# EAGLE board main_oled (EAGLE 9.6.2)
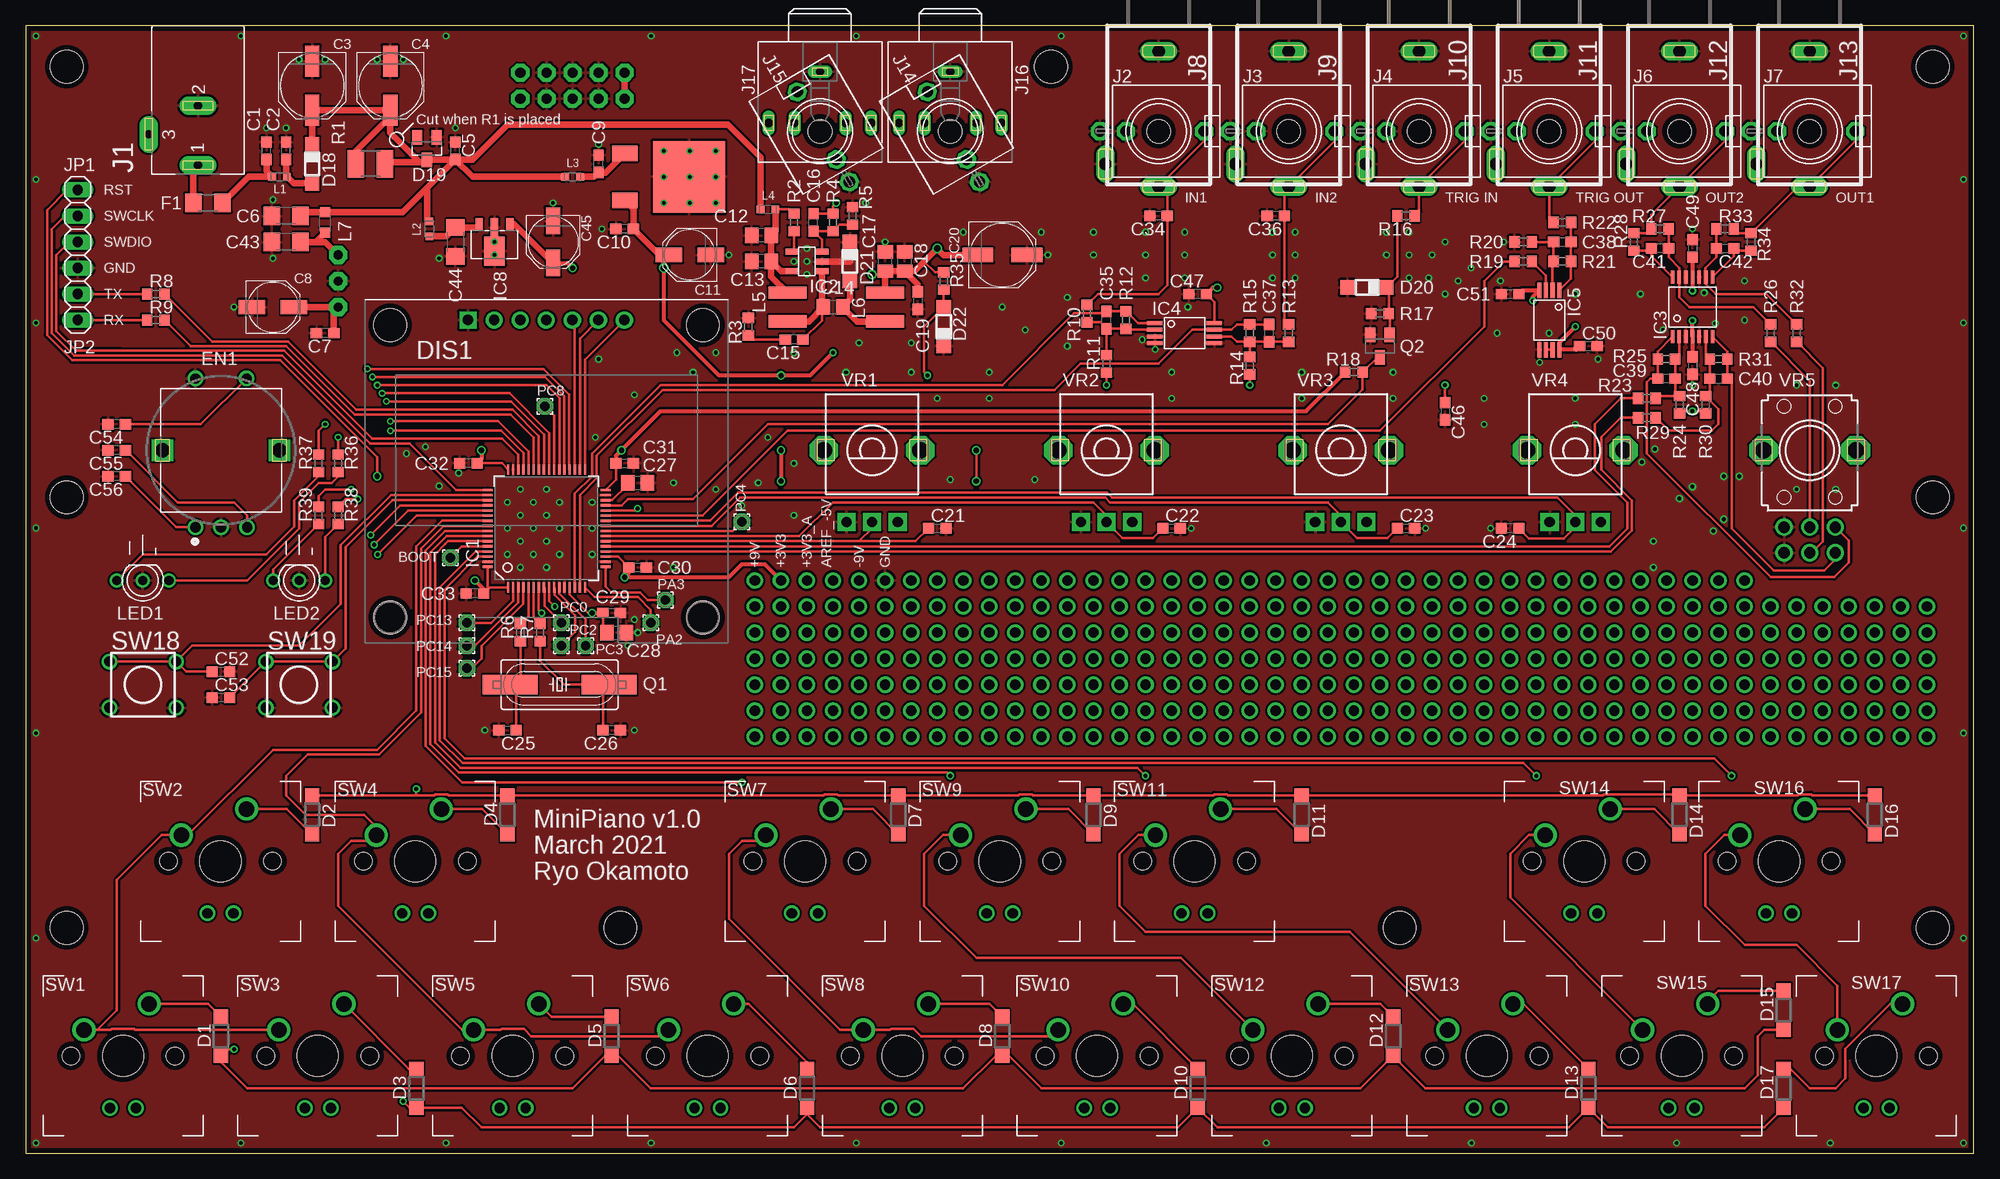
[diagram p4: board, top side]
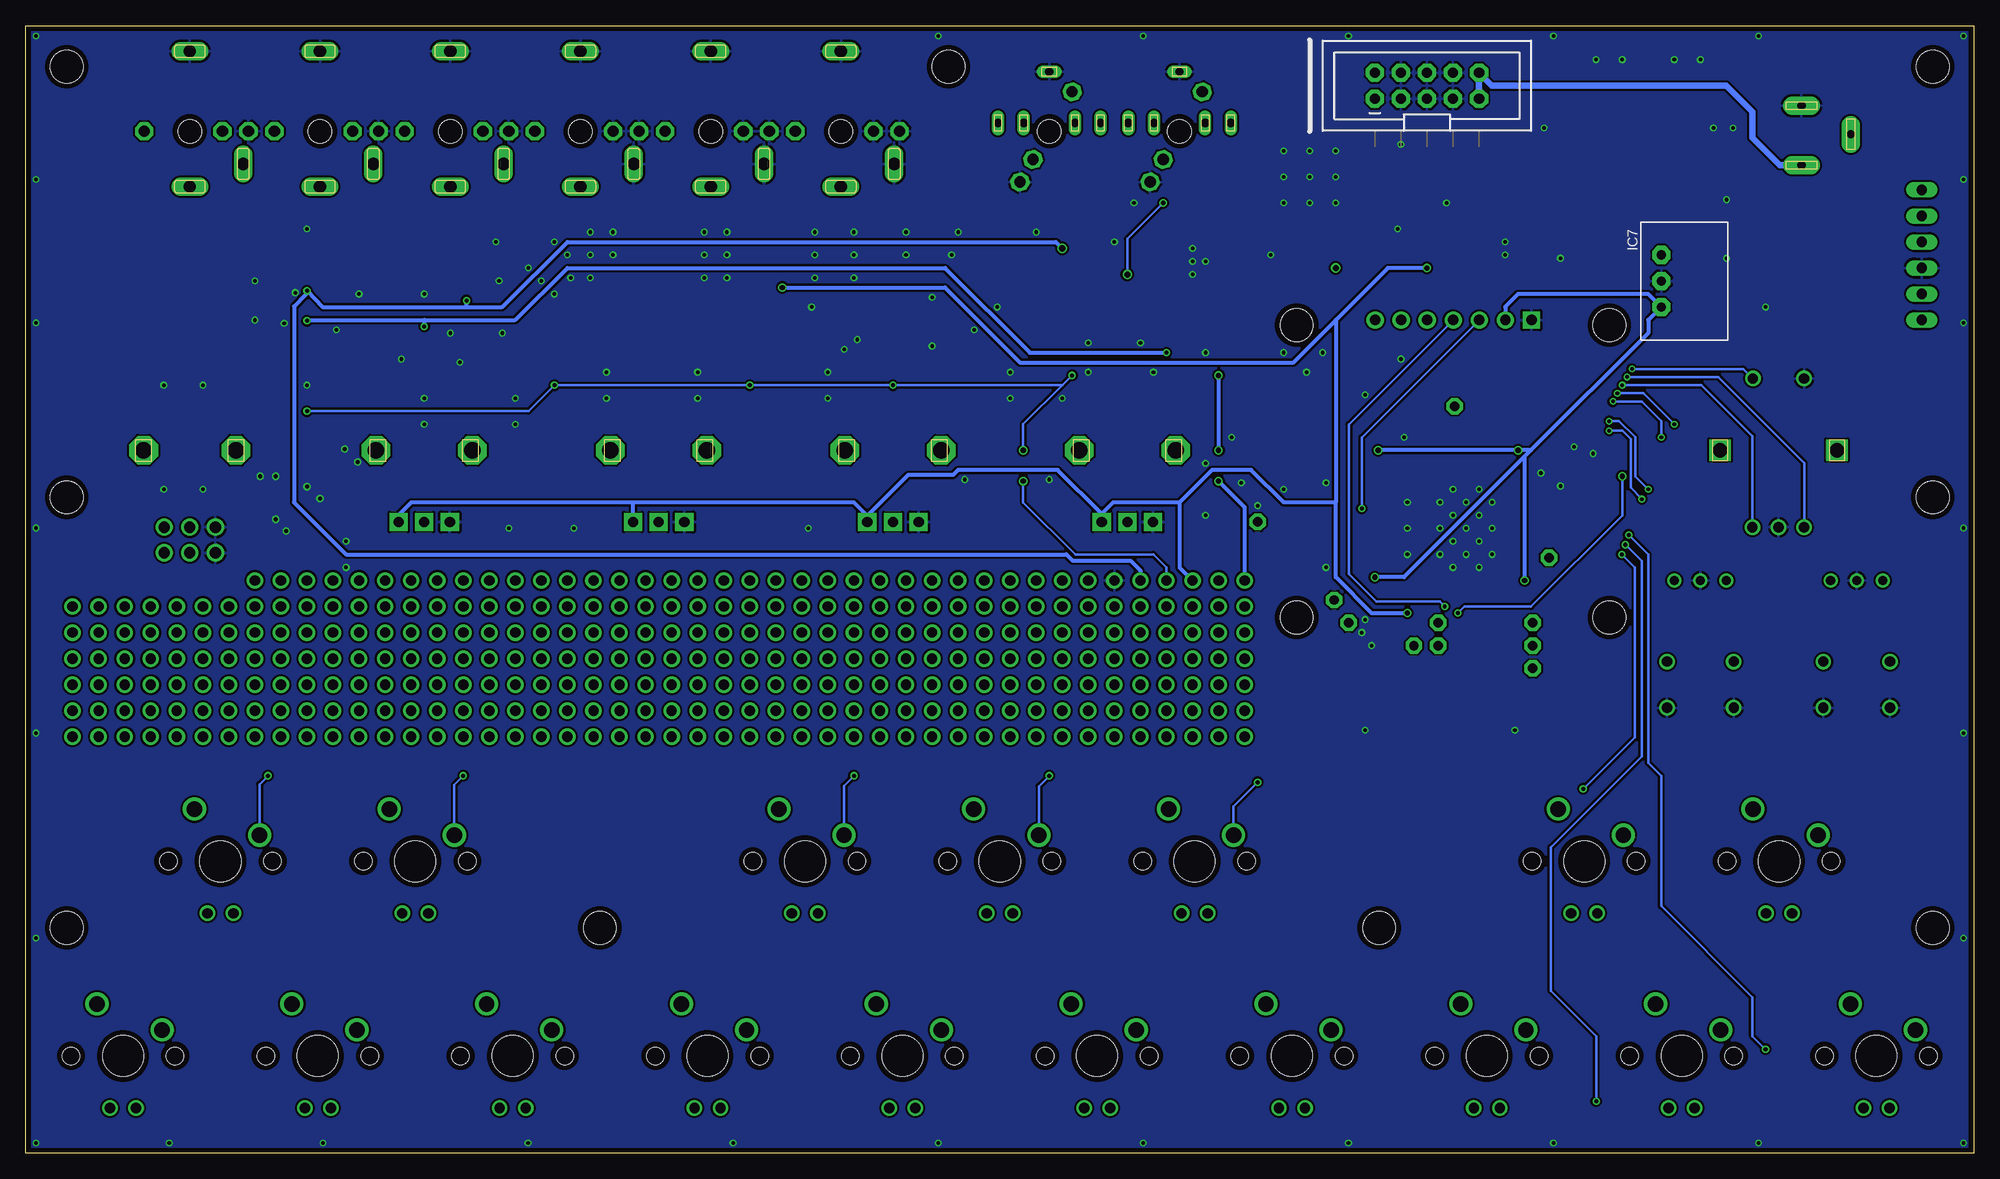
[diagram p5: board, bottom side, seen from below]

Size 190 x 110 mm. Coordinates in mm from the lower left corner, seen from the top.
Outline: 0,0 190,0 190,110 0,110 0,0
Copper layers (1*16): Top 0.035mm / dielectric 1.6mm / Bottom 0.035mm
Design rules "Elecrow_2-layer_PCB_eagle_rule_recom": minimum track width 8mil, minimum drill 12mil, track to track 8mil, track to pad 8mil, pad to pad 8mil, via to via 8mil, smd to smd 0mil, copper to edge 20mil, drill to drill 10mil, minimum pad ring 6mil, minimum via ring 6mil, stop-mask expansion 0mil, vias tented up to drill 100mil, thermal gap 10mil
Net classes: 0 default: width 0.254 mm; 1 GND: width 0.254 mm; 2 VCC: width 0.254 mm, drill 0.4 mm
Holes 3.2 mm at 4,22 186,106 4,106 100,106 58,22 4,64 186,64 134,22 186,22 35.56,52.27 66.04,52.27

## Footprints (pad centres in the part's own frame; a part is rotated, then mirrored left to right if it is on the bottom)
1,6/0,9 = drill 0.914 pad 1.6 octagon: 1 0,0
C0603 = smd 1.1 x 1: 1 -0.85,0; 2 0.85,0
PANASONIC_D = smd 3 x 1.4: + 2.4,0; - -2.4,0
C1206 = smd 1.6 x 1.8: 1 -1.4,0; 2 1.4,0
PANASONIC_C = smd 2.6 x 1.4: + 2.05,0; - -2.05,0
C0805 = smd 1.3 x 1.5: 1 -0.95,0; 2 0.95,0
SOD123 = smd 1.4 x 1.4: A 1.9,0; C -1.9,0
SOT23 = smd 1 x 1.4: 1 -0.95,-1.1; 2 0.95,-1.1; 3 0,1.1
OLED_130_SPI = drill 1.016 pad 1.676 square: 1 -7.65,12.7 | drill 1.016 pad 1.676: 2 -5.11,12.7; 3 -2.57,12.7; 4 -0.03,12.7; 5 2.51,12.7; 6 5.05,12.7; 7 7.59,12.7 | hole 3.2: -15.24,12.21; 15.24,12.21
PEC11L-4220F-S0015 = drill 1: 1 -2.5,7; 2 2.5,7; A -2.5,-7.5; B 2.55,-7.5; C 0,-7.5 | drill 1.4 square: M1 -5.7,0; M2 5.7,0
R1206 = smd 1.6 x 1.803: 1 -1.422,0; 2 1.422,0
TQFP64 = smd 0.22 x 1: 1 -3.75,-5.75; 2 -3.25,-5.75; 3 -2.75,-5.75; 4 -2.25,-5.75; 5 -1.75,-5.75; 6 -1.25,-5.75; 7 -0.75,-5.75; 8 -0.25,-5.75; 9 0.25,-5.75; 10 0.75,-5.75; 11 1.25,-5.75; 12 1.75,-5.75; 13 2.25,-5.75; 14 2.75,-5.75; 15 3.25,-5.75; 16 3.75,-5.75; 33 3.75,5.75; 34 3.25,5.75; 35 2.75,5.75; 36 2.25,5.75; 37 1.75,5.75; 38 1.25,5.75; 39 0.75,5.75; 40 0.25,5.75; 41 -0.25,5.75; 42 -0.75,5.75; 43 -1.25,5.75; 44 -1.75,5.75; 45 -2.25,5.75; 46 -2.75,5.75; 47 -3.25,5.75; 48 -3.75,5.75 | smd 1 x 0.22: 17 5.75,-3.75; 18 5.75,-3.25; 19 5.75,-2.75; 20 5.75,-2.25; 21 5.75,-1.75; 22 5.75,-1.25; 23 5.75,-0.75; 24 5.75,-0.25; 25 5.75,0.25; 26 5.75,0.75; 27 5.75,1.25; 28 5.75,1.75; 29 5.75,2.25; 30 5.75,2.75; 31 5.75,3.25; 32 5.75,3.75; 49 -5.75,3.75; 50 -5.75,3.25; 51 -5.75,2.75; 52 -5.75,2.25; 53 -5.75,1.75; 54 -5.75,1.25; 55 -5.75,0.75; 56 -5.75,0.25; 57 -5.75,-0.25; 58 -5.75,-0.75; 59 -5.75,-1.25; 60 -5.75,-1.75; 61 -5.75,-2.25; 62 -5.75,-2.75; 63 -5.75,-3.25; 64 -5.75,-3.75
SOT23-5 = smd 1.3 x 0.6: 1 -1.45,0.95; 2 -1.45,0; 3 -1.45,-0.95; 4 1.45,-0.95; 5 1.45,0.95
TSSOP14 = smd 1.26 x 0.36: 1 -2.9,1.95; 2 -2.9,1.3; 3 -2.9,0.65; 4 -2.9,0; 5 -2.9,-0.65; 6 -2.9,-1.3; 7 -2.9,-1.95; 8 2.9,-1.95; 9 2.9,-1.3; 10 2.9,-0.65; 11 2.9,0; 12 2.9,0.65; 13 2.9,1.3; 14 2.9,1.95
TSSOP8 = smd 1.5 x 0.4: 1 -2.9,0.975; 2 -2.9,0.325; 3 -2.9,-0.325; 4 -2.9,-0.975; 5 2.9,-0.975; 6 2.9,-0.325; 7 2.9,0.325; 8 2.9,0.975
TO252-3 = smd 7 x 7: GND 0,5 | smd 1.5 x 2.5: IN -2.3,-1.25; OUT 2.3,-1.25
R-78E = drill 0.9 pad 1.778 octagon: 1 -2.54,0; 2 0,0; 3 2.54,0
SOT89R = smd 0.7 x 1.1: 1 1.5,-1.75; 2 -1.5,-1.75 | smd 0.7 x 1.8: 3 0,-1.4 | smd 2 x 2.8: 4 0,0.9
694106301002 = drill 0.8 pad 1.8 long: 1 13.6,0; 2 7.8,0; 3 10.6,-4.8
WQP-PJ301M-12_JACK = drill 1.1 pad 1.778 octagon: 1 0,4.445; 2 0,-3.175; 3 0,-5.715 | hole 2.3: 0,0
PJ-302M = drill 1.2 long: S 2.5,0; T 15.7,0; TS 13.5,-5.2
SJ1-352X = drill 0.8 long: 1 4.5,0; 2 9.5,5; 3 9.5,2.5; 4 9.5,-2.5; 5 9.5,-5
1X04 = drill 1.016 long: 1 -3.81,0; 2 -1.27,0; 3 1.27,0; 4 3.81,0
1X02 = drill 1.016 long: 1 -1.27,0; 2 1.27,0
PIN_HEADER_SHROUDED_2X5 = drill 1 pad 1.778 octagon: 1 -5.08,-1.27; 2 -5.08,1.27; 3 -2.54,-1.27; 4 -2.54,1.27; 5 0,-1.27; 6 0,1.27; 7 2.54,-1.27; 8 2.54,1.27; 9 5.08,-1.27; 10 5.08,1.27
WE-CBF_0603(W=2.2) = smd 0.75 x 0.7: 1 -0.725,0; 2 0.725,0
NR40XX = smd 1.2 x 3.7: 1 -1.4,0; 2 1.4,0
L2012C = smd 1 x 1: 1 -1,0; 2 1,0
W115WSURKMGKW = drill 0.9: 1 -2.54,0; 2 0,0; 3 2.54,0
PERF_2.54 = drill 1 pad 1.6: 1 0,0
HC49UP = smd 5.334 x 1.93: 1 -4.826,0; 2 4.826,0
SOT23-BEC = smd 1 x 1.4: B -0.95,-1.1; C 0,1.1; E 0.95,-1.1
R1210 = smd 1.6 x 2.7: 1 -1.4,0; 2 1.4,0
R0603 = smd 1 x 1.1: 1 -0.85,0; 2 0.85,0
MX1A-XX[R/G/Y]W = drill 1.5: 1 -3.81,2.54; 2 2.54,5.08 | drill 1: 3 -1.27,-5.08; 4 1.27,-5.08 | hole 4: 0,0 | hole 1.7: -5.08,0; 5.08,0
TACT_TH = drill 1: P1 -3.25,2.25; P2 3.25,2.25; P3 -3.25,-2.25; P4 3.25,-2.25
9MM_V = drill 1 pad 1.778 square: 1 -2.5,-7; 2 0,-7; 3 2.5,-7 | drill 1.6 pad 2.8 octagon: M1 4.699,0; M2 -4.699,0
9MM_V_DUAL = drill 1.1 pad 1.676: 1 -2.5,-7.5; 2 0,-7.5; 3 2.5,-7.5; 4 -2.5,-10; 5 0,-10; 6 2.5,-10 | drill 1.6 pad 2.8 octagon: M1 4.5,0; M2 -4.5,0

## Placement (x,y rotation side)
BOOT  WIREPAD1,6/0,9  [1,6/0,9]  41.43,58.1 0 top
C1  0.01u  [C0603]  23.5,97.79 90 top
C2  0.01u  [C0603]  25.4,97.79 90 top
C3  100u  [PANASONIC_D]  27.94,104.14 270 top
C4  100u  [PANASONIC_D]  35.56,104.14 270 top
C5  0.1u  [C0603]  41.91,97.79 90 top
C6  22u  [C1206]  25.4,91.44 180 top
C7  0.1u  [C0603]  29.21,80.01 180 top
C8  22u  [PANASONIC_C]  24.13,82.55 0 top
C9  0.01u  [C0603]  55.88,96.52 90 top
C10  0.1u  [C0603]  58.42,90.17 180 top
C11  22u  [PANASONIC_C]  64.77,87.63 180 top
C12  10u  [C0805]  71.75,89.53 180 top
C13  1u  [C0805]  71.75,87 180 top
C14  2.2u  [C0805]  78.74,82.55 0 top
C15  220p  [C0603]  74.93,79.38 180 top
C16  470p  [C0603]  76.83,90.81 90 top
C17  10u  [C0805]  83.82,87 90 top
C18  10u  [C0805]  85.72,87 90 top
C19  0.1u  [C0603]  87,83.19 270 top
C20  100u  [PANASONIC_D]  95.25,87.63 0 top
C21  0.1u  [C0603]  88.9,60.96 0 top
C22  0.1u  [C0603]  111.76,60.96 0 top
C23  0.1u  [C0603]  134.62,60.96 0 top
C24  0.1u  [C0603]  144.78,60.96 180 top
C25  18p  [C0603]  46.99,41.27 0 top
C26  18p  [C0603]  57.15,41.27 180 top
C27  2.2u  [C0805]  59.69,65.41 0 top
C28  2.2u  [C0805]  57.63,50.8 0 top
C29  0.1u  [C0603]  57.15,52.7 0 top
C30  0.1u  [C0603]  59.69,57.15 0 top
C31  0.1u  [C0603]  58.42,67.31 0 top
C32  0.1u  [C0603]  43.18,67.31 180 top
C33  0.1u  [C0603]  43.81,54.61 180 top
C34  ESD  [C0603]  110.49,91.44 180 top
C35  47p  [C0603]  105.41,81.28 90 top
C36  ESD  [C0603]  121.92,91.44 180 top
C37  47p  [C0603]  121.28,80.01 90 top
C38  DNP  [C0603]  149.86,88.9 0 top
C39  47p  [C0603]  160.02,75.56 180 top
C40  47p  [C0603]  165.1,75.56 0 top
C41  47p  [C0603]  159.38,88.27 180 top
C42  47p  [C0603]  165.74,88.27 0 top
C43  22u  [C1206]  25.4,88.9 180 top
C44  22u  [C1206]  41.91,88.9 270 top
C45  22u  [PANASONIC_C]  51.44,88.9 270 top
C46  0.47u  [C0603]  138.43,72.39 270 top
C47  0.1u  [C0603]  114.3,83.82 180 top
C48  0.1u  [C0603]  162.56,76.83 270 top
C49  0.1u  [C0603]  162.56,88.27 270 top
C50  0.1u  [C0603]  152.4,78.74 0 top
C51  0.1u  [C0603]  144.78,83.82 0 top
C52  DNP  [C0603]  19.05,46.99 0 top
C53  DNP  [C0603]  19.05,44.45 180 top
C54  DNP  [C0603]  8.89,71.12 180 top
C55  DNP  [C0603]  8.89,68.58 180 top
C56  DNP  [C0603]  8.89,66.04 180 top
D1  [SOD123]  19.05,11.43 90 top
D2  [SOD123]  27.94,33.02 270 top
D3  [SOD123]  38.1,6.35 90 top
D4  [SOD123]  46.99,33.02 270 top
D5  [SOD123]  57.15,11.43 90 top
D6  [SOD123]  76.2,6.35 90 top
D7  [SOD123]  85.09,33.02 270 top
D8  [SOD123]  95.25,11.43 90 top
D9  [SOD123]  104.14,33.02 270 top
D10  [SOD123]  114.3,6.35 90 top
D11  [SOD123]  124.46,33.02 270 top
D12  [SOD123]  133.35,11.43 90 top
D13  [SOD123]  152.4,6.35 90 top
D14  [SOD123]  161.29,33.02 270 top
D15  [SOD123]  171.45,13.97 90 top
D16  [SOD123]  180.34,33.02 270 top
D17  [SOD123]  171.45,6.35 90 top
D18  1N5819-SOD123  [SOD123]  27.94,96.52 270 top
D19  DNP  [SOT23]  39.13,98.01 180 top
D20  1N4148  [SOD123]  130.81,84.45 180 top
D21  RB160MM  [SOD123]  80.39,87 270 top
D22  5V  [SOD123]  89.53,80.64 90 top
DIS1  OLED_130_SPI  [OLED_130_SPI]  50.8,68.58 0 top
EN1  PEC11L-4220F-S0015  [PEC11L-4220F-S0015]  19.05,68.58 0 top
F1  FUSE1206  [R1206]  17.78,92.71 0 top
IC1  STM32F722RET  [TQFP64]  50.8,60.96 0 top
IC2  LM2611  [SOT23-5]  76.2,87 180 top
IC3  TL084P  [TSSOP14]  162.56,82.55 90 top
IC4  TL072CPWR  [TSSOP8]  113.03,80.01 0 top
IC5  TL072CPWR  [TSSOP8]  148.59,81.28 270 top
IC6  9V  [TO252-3]  59.69,95.25 270 top
IC7  R-78E3.3-0.5  [R-78E]  30.48,85.09 270 bottom
IC8  LD2981ABU33  [SOT89R]  45.72,88.9 180 top
J1  694106301002  [694106301002]  16.81,110 270 top
J2  WQP-PJ301M-12_JACK  [WQP-PJ301M-12_JACK]  110.49,99.69 270 top
J3  WQP-PJ301M-12_JACK  [WQP-PJ301M-12_JACK]  123.19,99.69 270 top
J4  WQP-PJ301M-12_JACK  [WQP-PJ301M-12_JACK]  135.89,99.69 270 top
J5  WQP-PJ301M-12_JACK  [WQP-PJ301M-12_JACK]  148.59,99.69 270 top
J6  WQP-PJ301M-12_JACK  [WQP-PJ301M-12_JACK]  161.29,99.69 270 top
J7  WQP-PJ301M-12_JACK  [WQP-PJ301M-12_JACK]  173.99,99.69 270 top
J8  PJ-302M  [PJ-302M]  110.49,110 270 top
J9  PJ-302M  [PJ-302M]  123.19,110 270 top
J10  PJ-302M  [PJ-302M]  135.89,110 270 top
J11  PJ-302M  [PJ-302M]  148.59,110 270 top
J12  PJ-302M  [PJ-302M]  161.29,110 270 top
J13  PJ-302M  [PJ-302M]  173.99,110 270 top
J14  WQP-PJ301M-12_STEREO  [WQP-PJ301M-12_JACK]  90.17,99.69 30 top
J15  WQP-PJ301M-12_STEREO  [WQP-PJ301M-12_JACK]  77.47,99.69 30 top
J16  SJ1-352X  [SJ1-352X]  90.17,110 270 top
J17  SJ1-352X  [SJ1-352X]  77.47,110 270 top
JP1  [1X04]  5.08,90.17 90 top
JP2  [1X02]  5.08,82.55 90 top
JP3  PIN_HEADER_SHROUDED_2X5  [PIN_HEADER_SHROUDED_2X5]  53.34,104.14 0 bottom
L1  1000Ohm@100 MHz  [WE-CBF_0603(W=2.2)]  24.77,95.25 0 top
L2  1000Ohm@100 MHz  [WE-CBF_0603(W=2.2)]  39.37,90.17 270 top
L3  1000Ohm@100 MHz  [WE-CBF_0603(W=2.2)]  53.34,95.25 0 top
L4  1000Ohm@100 MHz  [WE-CBF_0603(W=2.2)]  72.39,92.08 0 top
L5  NRS4018T150MDGJ  [NR40XX]  74.3,82.55 90 top
L6  NRS4018T150MDGJ  [NR40XX]  83.82,82.55 270 top
L7  33u  [L2012C]  29.21,90.81 90 top
LED1  W115WSURKMGKW  [W115WSURKMGKW]  11.43,55.88 0 top
LED2  W115WSURKMGKW  [W115WSURKMGKW]  26.67,55.88 0 top
P1  PERF_2.54  [PERF_2.54]  86.36,55.88 0 top
P2  PERF_2.54  [PERF_2.54]  71.12,55.88 0 top
P3  PERF_2.54  [PERF_2.54]  73.66,55.88 0 top
P4  PERF_2.54  [PERF_2.54]  76.2,55.88 0 top
P5  PERF_2.54  [PERF_2.54]  78.74,55.88 0 top
P6  PERF_2.54  [PERF_2.54]  81.28,55.88 0 top
P7  PERF_2.54  [PERF_2.54]  83.82,55.88 0 top
P8  PERF_2.54  [PERF_2.54]  71.12,53.34 0 top
P9  PERF_2.54  [PERF_2.54]  73.66,53.34 0 top
P10  PERF_2.54  [PERF_2.54]  73.66,50.8 0 top
P11  PERF_2.54  [PERF_2.54]  73.66,48.26 0 top
P12  PERF_2.54  [PERF_2.54]  73.66,45.72 0 top
P13  PERF_2.54  [PERF_2.54]  73.66,43.18 0 top
P14  PERF_2.54  [PERF_2.54]  73.66,40.64 0 top
P15  PERF_2.54  [PERF_2.54]  71.12,50.8 0 top
P16  PERF_2.54  [PERF_2.54]  76.2,53.34 0 top
P17  PERF_2.54  [PERF_2.54]  76.2,50.8 0 top
P18  PERF_2.54  [PERF_2.54]  76.2,48.26 0 top
P19  PERF_2.54  [PERF_2.54]  76.2,45.72 0 top
P20  PERF_2.54  [PERF_2.54]  76.2,43.18 0 top
P21  PERF_2.54  [PERF_2.54]  76.2,40.64 0 top
P22  PERF_2.54  [PERF_2.54]  71.12,48.26 0 top
P23  PERF_2.54  [PERF_2.54]  78.74,53.34 0 top
P24  PERF_2.54  [PERF_2.54]  78.74,50.8 0 top
P25  PERF_2.54  [PERF_2.54]  78.74,48.26 0 top
P26  PERF_2.54  [PERF_2.54]  78.74,45.72 0 top
P27  PERF_2.54  [PERF_2.54]  78.74,43.18 0 top
P28  PERF_2.54  [PERF_2.54]  78.74,40.64 0 top
P29  PERF_2.54  [PERF_2.54]  71.12,45.72 0 top
P30  PERF_2.54  [PERF_2.54]  81.28,43.18 0 top
P31  PERF_2.54  [PERF_2.54]  83.82,48.26 0 top
P32  PERF_2.54  [PERF_2.54]  86.36,53.34 0 top
P33  PERF_2.54  [PERF_2.54]  86.36,40.64 0 top
P34  PERF_2.54  [PERF_2.54]  88.9,48.26 0 top
P35  PERF_2.54  [PERF_2.54]  81.28,53.34 0 top
P36  PERF_2.54  [PERF_2.54]  81.28,40.64 0 top
P37  PERF_2.54  [PERF_2.54]  83.82,45.72 0 top
P38  PERF_2.54  [PERF_2.54]  86.36,50.8 0 top
P39  PERF_2.54  [PERF_2.54]  88.9,55.88 0 top
P40  PERF_2.54  [PERF_2.54]  88.9,45.72 0 top
P41  PERF_2.54  [PERF_2.54]  81.28,50.8 0 top
P42  PERF_2.54  [PERF_2.54]  71.12,43.18 0 top
P43  PERF_2.54  [PERF_2.54]  83.82,43.18 0 top
P44  PERF_2.54  [PERF_2.54]  86.36,48.26 0 top
P45  PERF_2.54  [PERF_2.54]  88.9,53.34 0 top
P46  PERF_2.54  [PERF_2.54]  88.9,43.18 0 top
P47  PERF_2.54  [PERF_2.54]  81.28,48.26 0 top
P48  PERF_2.54  [PERF_2.54]  83.82,53.34 0 top
P49  PERF_2.54  [PERF_2.54]  83.82,40.64 0 top
P50  PERF_2.54  [PERF_2.54]  86.36,45.72 0 top
P51  PERF_2.54  [PERF_2.54]  88.9,50.8 0 top
P52  PERF_2.54  [PERF_2.54]  88.9,40.64 0 top
P53  PERF_2.54  [PERF_2.54]  81.28,45.72 0 top
P54  PERF_2.54  [PERF_2.54]  83.82,50.8 0 top
P55  PERF_2.54  [PERF_2.54]  71.12,40.64 0 top
P56  PERF_2.54  [PERF_2.54]  86.36,43.18 0 top
P57  PERF_2.54  [PERF_2.54]  91.44,55.88 0 top
P58  PERF_2.54  [PERF_2.54]  93.98,55.88 0 top
P59  PERF_2.54  [PERF_2.54]  96.52,55.88 0 top
P60  PERF_2.54  [PERF_2.54]  99.06,55.88 0 top
P61  PERF_2.54  [PERF_2.54]  101.6,55.88 0 top
P62  PERF_2.54  [PERF_2.54]  104.14,55.88 0 top
P63  PERF_2.54  [PERF_2.54]  106.68,55.88 0 top
P64  PERF_2.54  [PERF_2.54]  109.22,55.88 0 top
P65  PERF_2.54  [PERF_2.54]  111.76,55.88 0 top
P66  PERF_2.54  [PERF_2.54]  114.3,55.88 0 top
P67  PERF_2.54  [PERF_2.54]  91.44,53.34 0 top
P68  PERF_2.54  [PERF_2.54]  93.98,53.34 0 top
P69  PERF_2.54  [PERF_2.54]  96.52,53.34 0 top
P70  PERF_2.54  [PERF_2.54]  99.06,53.34 0 top
P71  PERF_2.54  [PERF_2.54]  101.6,53.34 0 top
P72  PERF_2.54  [PERF_2.54]  104.14,53.34 0 top
P73  PERF_2.54  [PERF_2.54]  106.68,53.34 0 top
P74  PERF_2.54  [PERF_2.54]  109.22,53.34 0 top
P75  PERF_2.54  [PERF_2.54]  111.76,53.34 0 top
P76  PERF_2.54  [PERF_2.54]  114.3,53.34 0 top
P77  PERF_2.54  [PERF_2.54]  91.44,50.8 0 top
P78  PERF_2.54  [PERF_2.54]  93.98,50.8 0 top
P79  PERF_2.54  [PERF_2.54]  96.52,50.8 0 top
P80  PERF_2.54  [PERF_2.54]  99.06,50.8 0 top
P81  PERF_2.54  [PERF_2.54]  101.6,50.8 0 top
P82  PERF_2.54  [PERF_2.54]  104.14,50.8 0 top
P83  PERF_2.54  [PERF_2.54]  106.68,50.8 0 top
P84  PERF_2.54  [PERF_2.54]  109.22,50.8 0 top
P85  PERF_2.54  [PERF_2.54]  111.76,50.8 0 top
P86  PERF_2.54  [PERF_2.54]  114.3,50.8 0 top
P87  PERF_2.54  [PERF_2.54]  91.44,48.26 0 top
P88  PERF_2.54  [PERF_2.54]  93.98,48.26 0 top
P89  PERF_2.54  [PERF_2.54]  96.52,48.26 0 top
P90  PERF_2.54  [PERF_2.54]  99.06,48.26 0 top
P91  PERF_2.54  [PERF_2.54]  101.6,48.26 0 top
P92  PERF_2.54  [PERF_2.54]  104.14,48.26 0 top
P93  PERF_2.54  [PERF_2.54]  106.68,48.26 0 top
P94  PERF_2.54  [PERF_2.54]  109.22,48.26 0 top
P95  PERF_2.54  [PERF_2.54]  111.76,48.26 0 top
P96  PERF_2.54  [PERF_2.54]  114.3,48.26 0 top
P97  PERF_2.54  [PERF_2.54]  91.44,45.72 0 top
P98  PERF_2.54  [PERF_2.54]  93.98,45.72 0 top
P99  PERF_2.54  [PERF_2.54]  96.52,45.72 0 top
P100  PERF_2.54  [PERF_2.54]  99.06,45.72 0 top
P101  PERF_2.54  [PERF_2.54]  101.6,45.72 0 top
P102  PERF_2.54  [PERF_2.54]  104.14,45.72 0 top
P103  PERF_2.54  [PERF_2.54]  91.44,40.64 0 top
P104  PERF_2.54  [PERF_2.54]  93.98,40.64 0 top
P105  PERF_2.54  [PERF_2.54]  96.52,40.64 0 top
P106  PERF_2.54  [PERF_2.54]  99.06,40.64 0 top
P107  PERF_2.54  [PERF_2.54]  91.44,43.18 0 top
P108  PERF_2.54  [PERF_2.54]  93.98,43.18 0 top
P109  PERF_2.54  [PERF_2.54]  96.52,43.18 0 top
P110  PERF_2.54  [PERF_2.54]  99.06,43.18 0 top
P111  PERF_2.54  [PERF_2.54]  101.6,43.18 0 top
P112  PERF_2.54  [PERF_2.54]  104.14,43.18 0 top
P113  PERF_2.54  [PERF_2.54]  116.84,55.88 0 top
P114  PERF_2.54  [PERF_2.54]  119.38,55.88 0 top
P115  PERF_2.54  [PERF_2.54]  121.92,55.88 0 top
P116  PERF_2.54  [PERF_2.54]  124.46,55.88 0 top
P117  PERF_2.54  [PERF_2.54]  127,55.88 0 top
P118  PERF_2.54  [PERF_2.54]  129.54,55.88 0 top
P119  PERF_2.54  [PERF_2.54]  116.84,43.18 0 top
P120  PERF_2.54  [PERF_2.54]  119.38,43.18 0 top
P121  PERF_2.54  [PERF_2.54]  116.84,40.64 0 top
P122  PERF_2.54  [PERF_2.54]  119.38,40.64 0 top
P123  PERF_2.54  [PERF_2.54]  116.84,53.34 0 top
P124  PERF_2.54  [PERF_2.54]  119.38,53.34 0 top
P125  PERF_2.54  [PERF_2.54]  121.92,53.34 0 top
P126  PERF_2.54  [PERF_2.54]  124.46,53.34 0 top
P127  PERF_2.54  [PERF_2.54]  127,53.34 0 top
P128  PERF_2.54  [PERF_2.54]  129.54,53.34 0 top
P129  PERF_2.54  [PERF_2.54]  121.92,40.64 0 top
P130  PERF_2.54  [PERF_2.54]  124.46,40.64 0 top
P131  PERF_2.54  [PERF_2.54]  127,40.64 0 top
P132  PERF_2.54  [PERF_2.54]  129.54,40.64 0 top
P133  PERF_2.54  [PERF_2.54]  116.84,50.8 0 top
P134  PERF_2.54  [PERF_2.54]  119.38,50.8 0 top
P135  PERF_2.54  [PERF_2.54]  121.92,50.8 0 top
P136  PERF_2.54  [PERF_2.54]  124.46,50.8 0 top
P137  PERF_2.54  [PERF_2.54]  127,50.8 0 top
P138  PERF_2.54  [PERF_2.54]  129.54,50.8 0 top
P139  PERF_2.54  [PERF_2.54]  106.68,45.72 0 top
P140  PERF_2.54  [PERF_2.54]  109.22,45.72 0 top
P141  PERF_2.54  [PERF_2.54]  111.76,45.72 0 top
P142  PERF_2.54  [PERF_2.54]  114.3,45.72 0 top
P143  PERF_2.54  [PERF_2.54]  116.84,48.26 0 top
P144  PERF_2.54  [PERF_2.54]  119.38,48.26 0 top
P145  PERF_2.54  [PERF_2.54]  121.92,48.26 0 top
P146  PERF_2.54  [PERF_2.54]  124.46,48.26 0 top
P147  PERF_2.54  [PERF_2.54]  127,48.26 0 top
P148  PERF_2.54  [PERF_2.54]  129.54,48.26 0 top
P149  PERF_2.54  [PERF_2.54]  106.68,43.18 0 top
P150  PERF_2.54  [PERF_2.54]  109.22,43.18 0 top
P151  PERF_2.54  [PERF_2.54]  111.76,43.18 0 top
P152  PERF_2.54  [PERF_2.54]  114.3,43.18 0 top
P153  PERF_2.54  [PERF_2.54]  116.84,45.72 0 top
P154  PERF_2.54  [PERF_2.54]  119.38,45.72 0 top
P155  PERF_2.54  [PERF_2.54]  121.92,45.72 0 top
P156  PERF_2.54  [PERF_2.54]  124.46,45.72 0 top
P157  PERF_2.54  [PERF_2.54]  127,45.72 0 top
P158  PERF_2.54  [PERF_2.54]  129.54,45.72 0 top
P159  PERF_2.54  [PERF_2.54]  106.68,40.64 0 top
P160  PERF_2.54  [PERF_2.54]  109.22,40.64 0 top
P161  PERF_2.54  [PERF_2.54]  111.76,40.64 0 top
P162  PERF_2.54  [PERF_2.54]  114.3,40.64 0 top
P163  PERF_2.54  [PERF_2.54]  101.6,40.64 0 top
P164  PERF_2.54  [PERF_2.54]  104.14,40.64 0 top
P165  PERF_2.54  [PERF_2.54]  121.92,43.18 0 top
P166  PERF_2.54  [PERF_2.54]  124.46,43.18 0 top
P167  PERF_2.54  [PERF_2.54]  127,43.18 0 top
P168  PERF_2.54  [PERF_2.54]  129.54,43.18 0 top
P169  PERF_2.54  [PERF_2.54]  132.08,55.88 0 top
P170  PERF_2.54  [PERF_2.54]  134.62,55.88 0 top
P171  PERF_2.54  [PERF_2.54]  137.16,55.88 0 top
P172  PERF_2.54  [PERF_2.54]  139.7,55.88 0 top
P173  PERF_2.54  [PERF_2.54]  142.24,55.88 0 top
P174  PERF_2.54  [PERF_2.54]  144.78,55.88 0 top
P175  PERF_2.54  [PERF_2.54]  147.32,55.88 0 top
P176  PERF_2.54  [PERF_2.54]  149.86,55.88 0 top
P177  PERF_2.54  [PERF_2.54]  152.4,55.88 0 top
P178  PERF_2.54  [PERF_2.54]  154.94,55.88 0 top
P179  PERF_2.54  [PERF_2.54]  132.08,53.34 0 top
P180  PERF_2.54  [PERF_2.54]  134.62,53.34 0 top
P181  PERF_2.54  [PERF_2.54]  137.16,53.34 0 top
P182  PERF_2.54  [PERF_2.54]  139.7,53.34 0 top
P183  PERF_2.54  [PERF_2.54]  142.24,53.34 0 top
P184  PERF_2.54  [PERF_2.54]  144.78,53.34 0 top
P185  PERF_2.54  [PERF_2.54]  147.32,53.34 0 top
P186  PERF_2.54  [PERF_2.54]  149.86,53.34 0 top
P187  PERF_2.54  [PERF_2.54]  152.4,53.34 0 top
P188  PERF_2.54  [PERF_2.54]  154.94,53.34 0 top
P189  PERF_2.54  [PERF_2.54]  132.08,50.8 0 top
P190  PERF_2.54  [PERF_2.54]  134.62,50.8 0 top
P191  PERF_2.54  [PERF_2.54]  137.16,50.8 0 top
P192  PERF_2.54  [PERF_2.54]  139.7,50.8 0 top
P193  PERF_2.54  [PERF_2.54]  142.24,50.8 0 top
P194  PERF_2.54  [PERF_2.54]  144.78,50.8 0 top
P195  PERF_2.54  [PERF_2.54]  147.32,50.8 0 top
P196  PERF_2.54  [PERF_2.54]  149.86,50.8 0 top
P197  PERF_2.54  [PERF_2.54]  152.4,50.8 0 top
P198  PERF_2.54  [PERF_2.54]  154.94,50.8 0 top
P199  PERF_2.54  [PERF_2.54]  132.08,48.26 0 top
P200  PERF_2.54  [PERF_2.54]  134.62,48.26 0 top
P201  PERF_2.54  [PERF_2.54]  137.16,48.26 0 top
P202  PERF_2.54  [PERF_2.54]  139.7,48.26 0 top
P203  PERF_2.54  [PERF_2.54]  142.24,48.26 0 top
P204  PERF_2.54  [PERF_2.54]  144.78,48.26 0 top
P205  PERF_2.54  [PERF_2.54]  147.32,48.26 0 top
P206  PERF_2.54  [PERF_2.54]  149.86,48.26 0 top
P207  PERF_2.54  [PERF_2.54]  152.4,48.26 0 top
P208  PERF_2.54  [PERF_2.54]  154.94,48.26 0 top
P209  PERF_2.54  [PERF_2.54]  132.08,45.72 0 top
P210  PERF_2.54  [PERF_2.54]  134.62,45.72 0 top
P211  PERF_2.54  [PERF_2.54]  137.16,45.72 0 top
P212  PERF_2.54  [PERF_2.54]  139.7,45.72 0 top
P213  PERF_2.54  [PERF_2.54]  142.24,45.72 0 top
P214  PERF_2.54  [PERF_2.54]  144.78,45.72 0 top
P215  PERF_2.54  [PERF_2.54]  147.32,45.72 0 top
P216  PERF_2.54  [PERF_2.54]  149.86,45.72 0 top
P217  PERF_2.54  [PERF_2.54]  152.4,45.72 0 top
P218  PERF_2.54  [PERF_2.54]  154.94,45.72 0 top
P219  PERF_2.54  [PERF_2.54]  132.08,43.18 0 top
P220  PERF_2.54  [PERF_2.54]  134.62,43.18 0 top
P221  PERF_2.54  [PERF_2.54]  137.16,43.18 0 top
P222  PERF_2.54  [PERF_2.54]  139.7,43.18 0 top
P223  PERF_2.54  [PERF_2.54]  142.24,43.18 0 top
P224  PERF_2.54  [PERF_2.54]  144.78,43.18 0 top
P225  PERF_2.54  [PERF_2.54]  132.08,40.64 0 top
P226  PERF_2.54  [PERF_2.54]  134.62,40.64 0 top
P227  PERF_2.54  [PERF_2.54]  137.16,40.64 0 top
P228  PERF_2.54  [PERF_2.54]  139.7,40.64 0 top
P229  PERF_2.54  [PERF_2.54]  142.24,40.64 0 top
P230  PERF_2.54  [PERF_2.54]  144.78,40.64 0 top
P231  PERF_2.54  [PERF_2.54]  147.32,40.64 0 top
P232  PERF_2.54  [PERF_2.54]  149.86,40.64 0 top
P233  PERF_2.54  [PERF_2.54]  152.4,40.64 0 top
P234  PERF_2.54  [PERF_2.54]  154.94,40.64 0 top
P235  PERF_2.54  [PERF_2.54]  157.48,55.88 0 top
P236  PERF_2.54  [PERF_2.54]  160.02,55.88 0 top
P237  PERF_2.54  [PERF_2.54]  162.56,55.88 0 top
P238  PERF_2.54  [PERF_2.54]  165.1,55.88 0 top
P239  PERF_2.54  [PERF_2.54]  167.64,55.88 0 top
P240  PERF_2.54  [PERF_2.54]  157.48,43.18 0 top
P241  PERF_2.54  [PERF_2.54]  160.02,43.18 0 top
P242  PERF_2.54  [PERF_2.54]  162.56,43.18 0 top
P243  PERF_2.54  [PERF_2.54]  165.1,43.18 0 top
P244  PERF_2.54  [PERF_2.54]  167.64,43.18 0 top
P245  PERF_2.54  [PERF_2.54]  157.48,53.34 0 top
P246  PERF_2.54  [PERF_2.54]  160.02,53.34 0 top
P247  PERF_2.54  [PERF_2.54]  162.56,53.34 0 top
P248  PERF_2.54  [PERF_2.54]  165.1,53.34 0 top
P249  PERF_2.54  [PERF_2.54]  167.64,53.34 0 top
P250  PERF_2.54  [PERF_2.54]  157.48,40.64 0 top
P251  PERF_2.54  [PERF_2.54]  160.02,40.64 0 top
P252  PERF_2.54  [PERF_2.54]  162.56,40.64 0 top
P253  PERF_2.54  [PERF_2.54]  165.1,40.64 0 top
P254  PERF_2.54  [PERF_2.54]  167.64,40.64 0 top
P255  PERF_2.54  [PERF_2.54]  157.48,50.8 0 top
P256  PERF_2.54  [PERF_2.54]  160.02,50.8 0 top
P257  PERF_2.54  [PERF_2.54]  162.56,50.8 0 top
P258  PERF_2.54  [PERF_2.54]  165.1,50.8 0 top
P259  PERF_2.54  [PERF_2.54]  167.64,50.8 0 top
P260  PERF_2.54  [PERF_2.54]  170.18,53.34 0 top
P261  PERF_2.54  [PERF_2.54]  172.72,53.34 0 top
P262  PERF_2.54  [PERF_2.54]  170.18,40.64 0 top
P263  PERF_2.54  [PERF_2.54]  170.18,43.18 0 top
P264  PERF_2.54  [PERF_2.54]  170.18,45.72 0 top
P265  PERF_2.54  [PERF_2.54]  157.48,48.26 0 top
P266  PERF_2.54  [PERF_2.54]  160.02,48.26 0 top
P267  PERF_2.54  [PERF_2.54]  162.56,48.26 0 top
P268  PERF_2.54  [PERF_2.54]  165.1,48.26 0 top
P269  PERF_2.54  [PERF_2.54]  167.64,48.26 0 top
P270  PERF_2.54  [PERF_2.54]  170.18,50.8 0 top
P271  PERF_2.54  [PERF_2.54]  147.32,43.18 0 top
P272  PERF_2.54  [PERF_2.54]  149.86,43.18 0 top
P273  PERF_2.54  [PERF_2.54]  152.4,43.18 0 top
P274  PERF_2.54  [PERF_2.54]  154.94,43.18 0 top
P275  PERF_2.54  [PERF_2.54]  157.48,45.72 0 top
P276  PERF_2.54  [PERF_2.54]  160.02,45.72 0 top
P277  PERF_2.54  [PERF_2.54]  162.56,45.72 0 top
P278  PERF_2.54  [PERF_2.54]  165.1,45.72 0 top
P279  PERF_2.54  [PERF_2.54]  167.64,45.72 0 top
P280  PERF_2.54  [PERF_2.54]  170.18,48.26 0 top
P281  PERF_2.54  [PERF_2.54]  172.72,50.8 0 top
P282  PERF_2.54  [PERF_2.54]  175.26,50.8 0 top
P283  PERF_2.54  [PERF_2.54]  177.8,50.8 0 top
P284  PERF_2.54  [PERF_2.54]  180.34,50.8 0 top
P285  PERF_2.54  [PERF_2.54]  175.26,53.34 0 top
P286  PERF_2.54  [PERF_2.54]  177.8,53.34 0 top
P287  PERF_2.54  [PERF_2.54]  172.72,48.26 0 top
P288  PERF_2.54  [PERF_2.54]  175.26,48.26 0 top
P289  PERF_2.54  [PERF_2.54]  177.8,48.26 0 top
P290  PERF_2.54  [PERF_2.54]  180.34,48.26 0 top
P291  PERF_2.54  [PERF_2.54]  182.88,48.26 0 top
P292  PERF_2.54  [PERF_2.54]  180.34,53.34 0 top
P293  PERF_2.54  [PERF_2.54]  172.72,45.72 0 top
P294  PERF_2.54  [PERF_2.54]  175.26,45.72 0 top
P295  PERF_2.54  [PERF_2.54]  177.8,45.72 0 top
P296  PERF_2.54  [PERF_2.54]  180.34,45.72 0 top
P297  PERF_2.54  [PERF_2.54]  182.88,45.72 0 top
P298  PERF_2.54  [PERF_2.54]  182.88,53.34 0 top
P299  PERF_2.54  [PERF_2.54]  172.72,43.18 0 top
P300  PERF_2.54  [PERF_2.54]  175.26,43.18 0 top
P301  PERF_2.54  [PERF_2.54]  177.8,43.18 0 top
P302  PERF_2.54  [PERF_2.54]  180.34,43.18 0 top
P303  PERF_2.54  [PERF_2.54]  182.88,43.18 0 top
P304  PERF_2.54  [PERF_2.54]  182.88,50.8 0 top
P305  PERF_2.54  [PERF_2.54]  172.72,40.64 0 top
P306  PERF_2.54  [PERF_2.54]  175.26,40.64 0 top
P307  PERF_2.54  [PERF_2.54]  177.8,40.64 0 top
P308  PERF_2.54  [PERF_2.54]  180.34,40.64 0 top
P309  PERF_2.54  [PERF_2.54]  185.42,53.34 0 top
P310  PERF_2.54  [PERF_2.54]  182.88,40.64 0 top
P311  PERF_2.54  [PERF_2.54]  185.42,45.72 0 top
P312  PERF_2.54  [PERF_2.54]  185.42,50.8 0 top
P313  PERF_2.54  [PERF_2.54]  185.42,40.64 0 top
P314  PERF_2.54  [PERF_2.54]  185.42,43.18 0 top
P315  PERF_2.54  [PERF_2.54]  185.42,48.26 0 top
PA2  WIREPAD1,6/0,9  [1,6/0,9]  60.96,51.75 0 top
PA3  WIREPAD1,6/0,9  [1,6/0,9]  62.39,53.98 0 top
PC0  WIREPAD1,6/0,9  [1,6/0,9]  52.23,51.75 0 top
PC2  WIREPAD1,6/0,9  [1,6/0,9]  52.23,49.53 0 top
PC3  WIREPAD1,6/0,9  [1,6/0,9]  54.61,49.53 0 top
PC4  WIREPAD1,6/0,9  [1,6/0,9]  69.85,61.59 0 top
PC8  WIREPAD1,6/0,9  [1,6/0,9]  50.64,72.87 0 top
PC13  WIREPAD1,6/0,9  [1,6/0,9]  43.02,51.75 0 top
PC14  WIREPAD1,6/0,9  [1,6/0,9]  43.02,49.53 0 top
PC15  WIREPAD1,6/0,9  [1,6/0,9]  43.02,47.31 0 top
Q1  24MHz  [HC49UP]  52.07,45.72 180 top
Q2  [SOT23-BEC]  132.08,78.74 180 top
R1  DNP  [R1210]  33.62,96.52 0 top
R2  60.4k  [R0603]  74.93,90.81 90 top
R3  47.5  [R0603]  70.48,80.64 270 top
R4  60.4k  [R0603]  78.74,90.81 90 top
R5  10k  [R0603]  80.64,91.44 270 top
R6  100  [R0603]  48.26,50.8 90 top
R7  100  [R0603]  50.16,50.8 90 top
R8  100  [R0603]  12.7,83.82 0 top
R9  100  [R0603]  12.7,81.28 0 top
R10  100k  [R0603]  103.5,81.92 270 top
R11  100k  [R0603]  105.41,77.01 90 top
R12  33k  [R0603]  107.31,81.28 90 top
R13  100k  [R0603]  123.19,80.01 270 top
R14  100k  [R0603]  119.38,76.83 90 top
R15  33k  [R0603]  119.38,80.01 90 top
R16  100k  [R0603]  134.62,91.44 180 top
R17  100k  [R0603]  132.08,81.92 0 top
R18  10k  [R0603]  129.54,76.2 180 top
R19  10k  [R0603]  146.05,87 0 top
R20  22k  [R0603]  146.05,88.9 0 top
R21  12k  [R0603]  149.86,87 0 top
R22  1.0k  [R0603]  149.86,90.81 180 top
R23  30k  [R0603]  158.12,73.66 0 top
R24  91k  [R0603]  161.29,73.03 90 top
R25  100k  [R0603]  160.02,77.47 180 top
R26  100k  [R0603]  170.18,80.01 90 top
R27  100k  [R0603]  159.38,90.17 180 top
R28  1.0k  [R0603]  156.84,88.9 90 top
R29  30k  [R0603]  158.12,71.75 0 top
R30  91k  [R0603]  163.83,73.03 90 top
R31  100k  [R0603]  165.1,77.47 0 top
R32  100k  [R0603]  172.72,80.01 90 top
R33  100k  [R0603]  165.74,90.17 0 top
R34  1.0k  [R0603]  168.28,88.9 90 top
R35  2.2k  [R0603]  89.53,85.09 90 top
R36  1.5k  [R0603]  30.48,67.31 270 top
R37  2.2k  [R0603]  28.57,67.31 90 top
R38  1.5k  [R0603]  30.48,62.23 270 top
R39  2.2k  [R0603]  28.57,62.23 90 top
SW1  CHERRY_MX_LED_WITH_FIXING_PINS  [MX1A-XX[R/G/Y]W]  9.5,9.5 0 top
SW2  CHERRY_MX_LED_WITH_FIXING_PINS  [MX1A-XX[R/G/Y]W]  19,28.5 0 top
SW3  CHERRY_MX_LED_WITH_FIXING_PINS  [MX1A-XX[R/G/Y]W]  28.5,9.5 0 top
SW4  CHERRY_MX_LED_WITH_FIXING_PINS  [MX1A-XX[R/G/Y]W]  38,28.5 0 top
SW5  CHERRY_MX_LED_WITH_FIXING_PINS  [MX1A-XX[R/G/Y]W]  47.5,9.5 0 top
SW6  CHERRY_MX_LED_WITH_FIXING_PINS  [MX1A-XX[R/G/Y]W]  66.5,9.5 0 top
SW7  CHERRY_MX_LED_WITH_FIXING_PINS  [MX1A-XX[R/G/Y]W]  76,28.5 0 top
SW8  CHERRY_MX_LED_WITH_FIXING_PINS  [MX1A-XX[R/G/Y]W]  85.5,9.5 0 top
SW9  CHERRY_MX_LED_WITH_FIXING_PINS  [MX1A-XX[R/G/Y]W]  95,28.5 0 top
SW10  CHERRY_MX_LED_WITH_FIXING_PINS  [MX1A-XX[R/G/Y]W]  104.5,9.5 0 top
SW11  CHERRY_MX_LED_WITH_FIXING_PINS  [MX1A-XX[R/G/Y]W]  114,28.5 0 top
SW12  CHERRY_MX_LED_WITH_FIXING_PINS  [MX1A-XX[R/G/Y]W]  123.5,9.5 0 top
SW13  CHERRY_MX_LED_WITH_FIXING_PINS  [MX1A-XX[R/G/Y]W]  142.5,9.5 0 top
SW14  CHERRY_MX_LED_WITH_FIXING_PINS  [MX1A-XX[R/G/Y]W]  152,28.5 0 top
SW15  CHERRY_MX_LED_WITH_FIXING_PINS  [MX1A-XX[R/G/Y]W]  161.5,9.5 0 top
SW16  CHERRY_MX_LED_WITH_FIXING_PINS  [MX1A-XX[R/G/Y]W]  171,28.5 0 top
SW17  CHERRY_MX_LED_WITH_FIXING_PINS  [MX1A-XX[R/G/Y]W]  180.5,9.5 0 top
SW18  TACT_TH  [TACT_TH]  11.43,45.72 0 top
SW19  TACT_TH  [TACT_TH]  26.67,45.72 0 top
VR1  [9MM_V]  82.55,68.58 0 top
VR2  [9MM_V]  105.41,68.58 0 top
VR3  [9MM_V]  128.27,68.58 0 top
VR4  [9MM_V]  151.13,68.58 0 top
VR5  100kA  [9MM_V_DUAL]  173.99,68.58 0 top

## Tracks (layer width: path | path; a pad name or v marks a point on that pad's centre or on a via)
+3V3  (via drill 0.5)
  Top 0.254: IC1.32 57.57,65.73 C31.1 | IC1.19 57.78,58.21 C30.1 | IC1.64 45.05,54.99 C33.1 45.27,55.21 IC1.1 | C32.1 46.45,67.31 IC1.48
  Top 0.406: v43.81,55.88 44.66,55.03 C33.1 | C30.1 58.84,56.62 v58.42,56.2 68.58,56.2 69.85,57.47 72.07,57.47 P3.1 | C31.1 57.57,68.05 v58.1,68.58 61.91,72.39 124.88,72.39 R18.2 | v44.45,68.58 44.45,67.73 C32.1
  Top 0.61: C8.+ IC7.3 30.06,82.13 C7.1
  Bottom 0.406: 43.18,68.58 31.75,80.01 31.75,81.28 IC7.3 31.75,83.82 44.45,83.82 45.69,82.58 DIS1.2 | 43.18,68.58 v44.45,68.58 v58.1,68.58 | 43.18,68.58 43.81,67.94 | 43.81,67.94 v43.81,55.88 | 43.81,67.94 55.56,56.2 v58.42,56.2
+3V3_A  (via drill 0.5)
  Top 0.254: IC1.13 53.05,54.53 54.87,52.7 C29.1 56.3,51.18 C28.1 | C47.1 115.93,83.04 IC4.8
  Top 0.406: C45.+ 52.85,86.85 v53.34,86.36 | v55.24,52.7 C29.1 | v116.2,84.45 115.78,84.45 C47.1
  Top 0.61: IC8.2 47.63,90.65 C45.+
  Bottom 0.406: v53.34,86.36 57.15,86.36 62.23,81.28 | 62.23,81.28 66.36,77.15 93.03,77.15 100.33,84.45 v116.2,84.45 | 62.23,81.28 62.23,63.5 | 62.23,63.5 62.23,56.2 58.74,52.7 v55.24,52.7 | 77.47,63.5 83.94,63.5 85.05,62.39 VR1.3 85.05,62.37 89.35,66.67 99.06,66.67 99.55,66.18 103.94,66.18 107.91,62.22 VR2.3 107.91,62.19 109.22,63.5 130.81,63.5 | 130.81,63.5 152.4,63.5 153.67,62.23 153.67,61.62 VR4.3 | VR3.3 130.77,63.46 130.81,63.5 | P4.1 77.47,57.15 77.47,63.5 | 62.23,63.5 67.31,63.5 70.48,66.67 74.3,66.67 77.47,63.5
ADC1
  Top 0.254: IC4.1 108.46,80.98 R12.2 C35.2 105.34,82.13 105.14,81.94 102.25,81.94 95.25,74.93 90.17,74.93 61.91,74.93 55.24,68.26 55.24,66.04 53.55,64.34 IC1.14
ADC3
  Top 0.254: C37.2 R15.2 118.11,80.86 117.58,80.33 IC4.7 113.81,80.33 110.49,77.01 102.87,77.01 100.33,74.47 62.1,74.47 55.7,68.07 55.7,65.85 54.05,64.2 IC1.15
AREF_-5V  (via drill 0.4, 0.5)
  Top 0.254: R35.1 D22.A 87.63,80.64 87.63,76.2 v87.95,75.88 | R30.1 163.62,72.39 v162.56,72.39 161.5,72.39 R24.1 | v105.41,74.93 R11.1 | R14.1 v119.38,74.93 | C46.1 v138.43,74.93 | v92.71,68.58 v92.71,65.56
  Bottom 0.254: v87.95,75.88 88.9,74.93 | 88.9,74.93 92.71,71.12 v92.71,68.58 | v162.56,72.39 140.97,72.39 v138.43,74.93 v119.38,74.93 v105.41,74.93 88.9,74.93 | v92.71,65.56 92.71,63.5 87.63,58.42 80.01,58.42 78.74,57.15 P5.1
COL1
  Top 0.254: SW3.1 10.69,12.04 10.59,12.13 8.41,12.13 8.31,12.04 SW1.1 6.96,12.04 8.89,13.97 8.89,26.67 13.26,31.04 SW2.1 15.8,31.04 24.13,39.37 34.29,39.37 38.1,43.18 38.1,59.18 40.63,61.71 IC1.55
COL2
  Top 0.254: SW6.1 62.69,11.89 62.23,11.43 49.3,11.43 48.59,12.13 46.41,12.13 46.31,12.04 SW5.1 42.57,12.04 30.48,24.13 30.48,29.21 31.75,30.48 33.63,30.48 SW4.1 34.19,31.85 33.02,33.02 27.3,33.02 25.4,34.92 25.4,36.83 27.48,38.91 34.48,38.91 38.56,42.99 38.56,58.99 40.78,61.21 IC1.56
COL3  (via drill 0.4)
  Top 0.254: SW7.1 71.63,30.48 69.85,30.48 68.58,29.21 68.58,22.86 79.4,12.04 SW8.1 84.31,12.04 84.41,12.13 86.59,12.13 87.32,11.4 100.06,11.4 SW10.1 | v69.85,36.2 42.55,36.2 39.01,39.73 39.01,58.8 40.92,60.71 IC1.57
  Bottom 0.254: v69.85,36.2 72.19,33.85 SW7.1
COL4  (via drill 0.4)
  Top 0.254: SW9.1 89.46,31.04 87.63,29.21 87.63,24.13 92.71,19.05 112.68,19.05 SW12.1 | v90.17,36.83 89.85,37.15 42.24,37.15 39.47,39.91 39.47,58.61 41.07,60.21 IC1.58
  Bottom 0.254: v90.17,36.83 91.19,35.81 SW9.1
COL5  (via drill 0.4)
  Top 0.254: SW11.1 108.51,31.04 106.68,29.21 106.68,24.13 109.22,21.59 129.14,21.59 SW13.1 | v109.22,36.83 108.44,37.6 42.43,37.6 39.93,40.1 39.93,58.42 40.92,59.41 41.22,59.71 IC1.59
  Bottom 0.254: v109.22,36.83 110.19,35.86 SW11.1
COL6  (via drill 0.4)
  Top 0.254: SW14.1 146.61,31.04 144.78,29.21 144.78,24.95 SW15.1 | v147.32,36.83 146.09,38.06 42.62,38.06 40.39,40.29 40.39,55.2 43.9,58.71 IC1.61
  Bottom 0.254: v147.32,36.83 148.19,35.96 SW14.1
COL7  (via drill 0.4)
  Top 0.254: SW16.1 165.66,31.04 163.83,29.21 163.83,24.13 167.64,20.32 172.72,20.32 176.69,16.35 SW17.1 | v166.37,36.83 164.68,38.52 42.81,38.52 40.84,40.48 40.84,55.01 44.04,58.21 IC1.62
  Bottom 0.254: v166.37,36.83 167.19,36.01 SW16.1
DAC1
  Top 0.254: IC1.20 154.61,58.71 156.67,60.77 156.67,63.69 153.67,66.69 153.67,69.85 155.57,71.75 R29.1
DAC2
  Top 0.254: IC1.21 154.46,59.21 156.21,60.96 156.21,63.5 153.03,66.67 153.03,71.12 155.57,73.66 R23.1
DISP_DC
  Top 0.254: DIS1.6 54.05,79.48 IC1.34
DISP_RES
  Top 0.254: DIS1.5 53.55,81.04 IC1.35
ENC_2  (via drill 0.35)
  Top 0.254: IC1.36 53.01,66.75 53.01,74.02 50.51,76.52 v33.34,76.52 | C54.1 17.09,71.12 EN1.2
  Bottom 0.254: v33.34,76.52 22.49,76.52 EN1.2
ENC_A  (via drill 0.35)
  Top 0.254: IC1.37 52.53,66.73 52.53,73.85 50.65,75.72 v33.81,75.72 | C56.1 14.7,61.08 EN1.A
  Bottom 0.254: EN1.A 16.55,67.35 24.92,75.72 v33.81,75.72
ENC_B  (via drill 0.35)
  Top 0.254: v34.29,74.93 50.8,74.93 52.07,73.66 52.07,66.73 IC1.38 | C55.1 14.82,63.5 20.32,63.5 21.6,62.22 EN1.B
  Bottom 0.254: v34.29,74.93 26.56,74.93 21.6,69.97 EN1.B
GND  (via drill 0.35, 0.4)
  Top 0.61: D21.C 80.39,87 IC2.2
  other vias: 163.7,83.95 162.56,74.93 158.88,68.71 162.56,65.02 165.61,66.04 165.61,61.85 164.59,60.71 167.13,66.04 161.29,63.88 157.61,67.44 42.23,66.36 39,68.92 74.93,62.23 101.6,78.74 45.72,88.9 45.72,87.63 62.23,97.79 62.23,95.25 62.23,92.71 64.77,92.71 64.77,95.25 64.77,97.79 67.31,97.79 67.31,95.25 67.31,92.71 76.2,88.27 76.2,87 76.2,85.72 74.93,87 48.26,57.15 46.99,58.42 46.99,60.96 46.99,63.5 48.26,62.23 48.26,59.69 49.53,60.96 49.53,58.42 50.8,57.15 50.8,59.69 52.07,58.42 52.07,60.96 50.8,62.23 49.53,63.5 48.26,64.77 50.8,64.77 52.07,63.5 55.24,63.5 55.24,60.96 55.24,58.42 44.77,41.27 59.37,41.27 59.37,52.07 59.69,50.8 58.74,49.53 37.15,68.26 40.32,65.09 63.18,57.15 55.56,69.85 63.18,65.41 90.17,65.72 98.42,65.72 68.58,87.63 51.44,92.71 81.92,92.71 81.28,79.06 80.01,76.2 86.36,76.2 86.36,79.06 95.25,82.55 97.47,80.33 113.35,82.55 153.35,77.47 143.83,85.09 162.56,90.17 72.39,69.85 67.31,64.77 110.17,78.42 108.9,79.38 147.64,77.15 144.15,88.9 159.7,80.33 164.78,80.96 1,1 1,21 1,41 1,61 1,81 1,109 21,109 41,109 61,109 81,109 101,109 189,109 189,1 189,21 189,41 189,61 189,81 189,95 21,1 41,1 61,1 81,1 101,1 121,1 141,1 161,1 176,1 1,95 99.69,87.63 83.82,88.9 91.44,89.85 104.14,89.85 99.06,89.85 101.6,83.5 104.14,87.63 109.22,87.63 109.22,85.41 109.22,89.85 113.03,89.85 113.03,87.63 113.03,85.41 121.6,89.85 121.6,87.63 121.6,85.41 123.83,89.85 123.83,87.63 123.83,85.41 132.72,89.85 132.72,87.63 134.94,85.41 134.94,87.63 134.94,89.85 137.16,87.63 138.43,88.9 139.7,85.09 140.97,86.36 138.43,83.82 136.84,85.41 143.51,80.01 148.59,80.01 151.13,83.82 157.48,83.82 167.64,81.28 167.64,85.09 172.72,74.93 176.53,74.93 172.72,64.77 176.53,64.77 158.75,59.69 158.75,57.15 69.85,63.18 71.44,65.41 74.93,67.31 113.67,60.96 136.53,60.96 142.88,60.96 55.88,77.47 59.37,73.98 65.09,76.2 63.5,78.11 67.31,78.11 74.93,78.11 88.9,73.66 93.98,73.66 93.98,76.2 111.76,73.66 111.76,76.2 124.46,73.66 124.46,76.2 133.35,73.66 133.35,76.2 142.24,71.12 142.24,73.66 151.13,71.12 151.13,73.66 20.32,82.55 26.67,106.68 29.21,106.68 34.29,106.68 36.83,106.68 23.5,100.01 25.4,100.01 24.13,87.31 24.13,93.03 40.32,87.31 55.88,98.42 41.91,100.01 56.2,90.17
  pour Top: -2.54,111.76 191.77,111.76 191.77,-2.54 -2.54,-2.54
  pour Bottom: -1.27,110.49 191.77,110.49 191.77,-1.27 -1.27,-1.27
LED1G  (via drill 0.35)
  Top 0.254: R36.1 v30.48,69.85 | IC1.41 50.55,70.12 47.33,73.35 v35.19,73.35
  Bottom 0.254: v30.48,69.85 30.48,71.44 32.39,73.35 v35.19,73.35
LED1R  (via drill 0.35)
  Top 0.254: R37.2 28.57,70.48 v29.21,71.12 | v34.77,74.14 47.18,74.14 51.05,70.27 IC1.40
  Bottom 0.254: v29.21,71.12 32.23,74.14 v34.77,74.14
LED2G  (via drill 0.35)
  Top 0.254: R38.1 31.22,63.82 v32.38,63.82 | IC1.45 48.55,68.29 46.35,70.48 v35.56,70.48
  Bottom 0.254: v32.38,63.82 32.38,63.84 33.48,64.93 33.48,69.66 34.3,70.48 v35.56,70.48
LED2R  (via drill 0.35)
  Top 0.254: R39.2 28.57,64.14 29.21,64.77 v31.75,64.77 | v35.56,71.42 46.07,71.42 49.05,68.44 IC1.44
  Bottom 0.254: v31.75,64.77 33.02,66.04 33.02,69.85 34.61,71.44 35.56,71.44 v35.56,71.42
N$1
  Top 0.254: LED1.3 21.59,55.88 26.67,60.96 26.67,63.5 28.57,65.41 29.84,65.41 30.48,66.04 R36.2
N$2
  Top 0.254: LED1.1 11.43,58.42 23.48,58.42 26.21,61.15 26.21,63.69 28.57,66.05 R37.1
N$3
  Top 0.254: R38.2 29.21,60.11 LED2.3
N$4
  Top 0.254: R39.1 24.13,56.94 LED2.1
N$5
  Top 0.254: IC1.2 47.55,53.9 45.4,51.75 PC13.1
N$6
  Top 0.254: IC1.3 48.01,55.17 48.01,53.71 43.83,49.53 PC14.1
N$7
  Top 0.254: IC1.4 48.51,55.17 48.51,53.56 44.45,49.51 44.45,48.26 43.5,47.31 PC15.1
N$8
  Top 0.254: IC1.8 50.59,55.17 50.59,53.41 52.23,51.77 PC0.1
N$9
  Top 0.254: IC1.11 52.05,54.63 54.61,52.07 PC3.1
N$10
  Top 0.254: SW1.2 17.8,14.58 D1.A
N$11
  Top 0.254: SW2.2 25.48,33.58 D2.A
N$12
  Top 0.254: SW3.2 37.37,8.25 D3.A
N$13
  Top 0.254: SW4.2 44.53,33.58 D4.A
N$14
  Top 0.254: SW5.2 51.29,13.33 D5.A
N$15
  Top 0.254: SW6.2 70.51,14.58 76.2,8.89 D6.A
N$16
  Top 0.254: SW7.2 82.63,33.58 D7.A
N$17
  Top 0.254: SW8.2 94,14.58 D8.A
N$18
  Top 0.254: SW9.2 101.68,33.58 D9.A
N$19
  Top 0.254: SW10.2 107.97,14.58 D10.A
N$20
  Top 0.254: SW11.2 122,33.58 D11.A
N$21
  Top 0.254: SW12.2 132.1,14.58 D12.A
N$22
  Top 0.254: SW13.2 146.07,14.58 D13.A
N$23
  Top 0.254: SW14.2 158.83,33.58 D14.A
N$24
  Top 0.254: D15.A 165.1,15.87 164.04,14.81 SW15.2
N$25
  Top 0.254: SW16.2 177.88,33.58 D16.A
N$26
  Top 0.254: D17.A 172.09,8.25 173.99,6.35 176.53,6.35 177.48,7.3 177.48,10.21 181.85,14.58 SW17.2
N$27
  Top 0.254: IC1.16 55.5,54.26 59.73,54.26 60.96,53.02 PA2.1
N$28
  Top 0.254: JP2.1 R9.1
N$29
  Top 0.254: JP2.2 R8.1
N$30
  Top 0.61: J1.1 16.36,95.95 F1.1
  Bottom 0.61: JP3.9 JP3.10 46.99,104.14 24.13,104.14 21.59,101.6 21.59,99.06 18.93,96.4 J1.1
N$31
  Top 0.61: C2.1 25.4,95.34 L1.2 26.12,94.62 D18.A
N$32
  Top 0.61: C1.1 23.5,95.8 L1.1 21.74,95.25 F1.2
N$33
  Top 0.254: R2.2 74.81,91.66 74.39,92.08 L4.2
  Top 0.61: L4.2 73.11,89.94 C12.1 C13.1 | C13.1 72.7,85.54 L5.2 | C13.1 73.66,86.05 IC2.5
N$34
  Top 0.254: C15.1 77.65,81.25 77.65,82.69
  Top 0.61: IC2.1 77.65,82.69 C14.1 76.39,81.15 L5.1
N$35
  Top 0.254: R2.1 74.93,88.12 IC2.4
N$36
  Top 0.254: C15.2 70.91,79.38 R3.2
N$37
  Top 0.254: IC2.3 77.65,89.14 C16.1 R4.1 79.38,90.59 R5.2
N$38
  Top 0.254: IC1.5 49.05,52.44 R6.2
N$39
  Top 0.254: IC1.6 49.55,52.27 R7.2
N$40
  Top 0.254: R6.1 48.26,46.74 Q1.2 47.84,45.12 C25.2
N$41
  Top 0.254: R7.1 50.16,48.05 52.49,45.72 Q1.1 56.3,45.12 C26.2
N$42
  Top 0.254: IC1.30 57.2,63.71 58.74,65.25 C27.1
N$43
  Top 0.254: J2.1 114.94,98.75 J8.T 111.34,93.45 C34.1 111.34,84.67 110.49,83.82 104.56,83.82 R10.1
N$44
  Top 0.254: IC4.2 107.41,80.33 R12.1 C35.1 | C35.1 104.78,81.06 R10.2 | C35.1 R11.2
N$45
  Top 0.254: J4.1 140.34,98.75 J10.T 135.89,91.86 R16.1
N$46
  Top 0.254: J3.1 127.64,98.75 J9.T 122.77,93.88 C36.1 122.77,81.28 R13.1
N$47
  Top 0.254: R15.1 C37.1 R13.2 | R15.1 118.11,79.16 117.58,79.69 IC4.6 | R15.1 R14.2
N$48
  Top 0.254: Q2.B 133.03,81.81 R17.2 132.93,84.23 D20.C 133.77,85.52 R16.2
N$49
  Top 0.61: D21.A 80.39,83.25 C14.2 81.09,81.15 L6.2
N$50
  Top 0.61: L3.2 55.46,95.25 C9.1 56.56,95.67 IC6.IN
N$51
  Top 0.254: R26.1 173.99,75.35 VR5.2
N$52
  Top 0.254: IC3.2 161.26,77.86 R25.1 C39.1 160.87,74.3 R24.2 159.18,73.88 R23.2
N$53
  Top 0.254: J6.1 165.74,98.75 J12.T 158.53,91.55 R27.2 158.12,89.75 R28.2
N$54
  Top 0.254: R27.1 C41.1 160.24,87.42 161.29,86.36 161.29,85.48 IC3.13 161.26,83.53 162.24,82.55 168.49,82.55 R26.2
N$55
  Top 0.254: IC3.6 163.86,77.86 R31.1 C40.1 164.25,74.3 R30.2 165.1,72.61 165.1,71.12 164.47,70.48 160.24,70.48 R29.2
N$56
  Top 0.254: R28.1 158.32,88.05 C41.2 158.53,87.53 IC3.14
N$57
  Top 0.254: R32.1 175.26,76.62 175.26,59.69 174.15,58.58 VR5.5
N$58
  Top 0.254: IC5.1 150.71,85.33 R21.2 C38.2 R22.1
N$59
  Top 0.254: IC3.1 159.17,78.21 R25.2 C39.2 158.43,75.56 158.12,75.25 158.12,68.26 170.18,56.2 176.37,56.2 177.8,57.63 177.8,59.77 VR5.3
N$60
  Top 0.254: IC3.7 165.95,78.21 R31.2 C40.2 166.37,75.14 166.37,60.96 170.5,56.83 175.42,56.83 176.49,57.9 VR5.6
N$61
  Top 0.254: R33.1 C42.1 164.88,87.42 163.83,86.36 163.83,85.48 IC3.9 163.86,84.79 164.83,83.82 169.76,83.82 R32.2
N$62
  Top 0.254: IC3.8 166.59,87.53 C42.2 166.8,88.05 R34.1
N$63
  Top 0.254: J7.1 178.44,98.75 J13.T 172.82,94.3 R34.2 167,89.75 R33.2
N$64
  Top 0.254: IC5.2 148.91,86.9 R21.1 C38.1 R20.2
N$65
  Top 0.254: R19.2 148.26,85.63 IC5.3
N$66
  Top 0.254: J5.1 153.03,98.75 J11.T 148.59,91.22 R22.2
N$67
  Top 0.61: L7.1 28.3,88.9 C43.1 29.21,88.9 IC7.1
N$68
  Top 0.61: L2.2 41.05,89.44 C44.1 43.87,90.3 IC8.1
N$69
  Top 0.254: IC1.17 56.55,55.31 57.15,54.72 59.91,54.72 60.65,53.98 PA3.1
N$70
  Top 0.254: IC1.24 68.97,60.71 PC4.1
N$71
  Top 0.254: IC5.6 IC5.7
N$73
  Top 0.254: PC8.1 51.55,71.96 IC1.39
N$74
  Top 0.254: IC1.60 42.54,59.21 BOOT.1
N$79
  Top 0.61: JP3.2 JP3.1
POT1
  Top 0.254: IC1.22 81.3,59.71 | 81.3,59.71 86.36,59.71 86.38,59.71 86.8,59.71 C21.1 | 81.3,59.71 82.55,60.96 VR1.2
POT2
  Top 0.254: IC1.23 75.45,60.21 78.74,63.5 104.14,63.5 105.41,62.23 VR2.2 106.98,60.01 109.96,60.01 C22.1
POT3
  Top 0.254: IC1.25 66.88,61.21 69.65,63.98 105.29,63.98 105.77,63.5 127,63.5 128.27,62.23 VR3.2 129.84,60.01 132.82,60.01 C23.1
POT4
  Top 0.254: IC1.26 66.73,61.71 69.46,64.44 105.48,64.44 105.96,63.96 149.4,63.96 151.13,62.23 VR4.2 151.13,61.1 150.02,59.99 146.6,59.99 C24.1
RESET  (via drill 0.35, 0.5)
  Top 0.254: JP1.4 4.04,93.98 2.08,92.02 2.08,79.82 4.54,77.37 24.83,77.37 34.29,67.91 v34.29,66.04 | v50.32,52.7 50.05,52.98 IC1.7
  Bottom 0.254: v34.29,66.04 34.29,62.23 43.18,53.34 49.69,53.34 v50.32,52.7
ROW1  (via drill 0.4)
  Top 0.254: D15.C 169.55,12.07 168.91,11.43 168.91,7.62 167.64,6.35 136.53,6.35 D12.C 130.17,6.35 99.06,6.35 95.69,9.72 95.25,9.27 D8.C 94.62,9.53 91.44,6.35 60.96,6.35 57.53,9.78 57.53,9.4 57.28,9.4 D5.C 56.52,9.53 53.34,6.35 21.59,6.35 19.05,8.89 D1.C 19.68,10.16 v20.32,10.16 | IC1.52 36.54,63.21 v33.66,60.33
  Bottom 0.254: v20.32,10.16 21.59,11.43 21.59,15.24 30.48,24.13 30.48,36.83 31.75,38.1 31.75,58.42 v33.66,60.33
ROW2  (via drill 0.4)
  Top 0.254: 76.2,3.81 74.93,2.54 44.45,2.54 42.54,4.45 D3.C 37.46,4.45 v36.83,5.08 | D6.C 76.2,3.81 | 76.2,3.81 77.47,2.54 112.39,2.54 D10.C 116.21,2.54 150.49,2.54 D13.C 154.31,2.54 169.54,2.54 D17.C | IC1.53 37.32,62.71 v33.98,59.37
  Bottom 0.254: v36.83,5.08 36.83,11.43 41.27,15.88 41.27,29.84 32.38,38.73 32.38,57.77 v33.98,59.37
ROW3  (via drill 0.4)
  Top 0.254: D2.C 38.1,34.92 | 38.1,34.92 39.82,34.92 39.94,35.03 41.14,35.03 41.26,34.92 D4.C 77.82,34.92 77.94,35.03 79.14,35.03 79.26,34.92 D7.C 96.82,34.92 96.94,35.03 98.14,35.03 98.26,34.92 D9.C 115.82,34.92 115.94,35.03 117.14,35.03 117.26,34.92 D11.C 153.82,34.92 153.94,35.03 160.54,35.03 160.66,34.92 D14.C 172.82,34.92 172.94,35.03 174.14,35.03 174.26,34.92 D16.C | 38.1,34.92 v38.1,35.56 | IC1.54 38.13,62.21 v34.34,58.42
  Bottom 0.254: v38.1,35.56 33.07,40.59 33.07,57.15 v34.34,58.42
RX
  Top 0.254: R9.2 16.09,78.74 25.4,78.74 32.07,72.07 47.31,72.07 49.55,69.83 IC1.43
SPI2_CS
  Top 0.254: IC1.33 54.55,77.44 DIS1.7
SPI2_MISO
  Top 0.254: IC1.10 51.59,55.17 51.59,54.44 53.57,52.46 53.57,50.88 PC2.1
SPI2_MOSI  (via drill 0.35)
  Top 0.254: v51.59,53.34 51.05,53.88 IC1.9
  Bottom 0.254: DIS1.4 60.96,71.09 60.96,56.52 58.26,53.82 52.07,53.82 v51.59,53.34
SPI2_SCK  (via drill 0.4)
  Top 0.254: v59.69,62.89 59.5,62.71 IC1.28
  Bottom 0.254: v59.69,62.89 59.69,69.82 DIS1.3
SWCLK
  Top 0.254: JP1.3 3.81,91.44 2.54,90.17 2.54,80.01 4.72,77.83 25.02,77.83 33.6,69.25 37.43,69.25 41.97,64.71 IC1.49
SWDIO
  Top 0.254: IC1.46 48.05,68.14 46.48,69.71 33.78,69.71 25.21,78.28 10.16,78.28 9.35,78.28 4.91,78.28 3,80.2 3,87.63 4.27,88.9 JP1.2
TACT1
  Top 0.254: SW18.P1 SW18.P2 | SW18.P2 16.24,49.53 26.67,49.53 30.73,53.59 30.73,59.32 35.62,64.21 IC1.50 | SW18.P2 15.66,46.99 C52.1
TACT2
  Top 0.254: IC1.51 35.77,63.71 31.19,59.13 31.19,49.24 SW19.P2 SW19.P1 C53.1
TRIG_IN
  Top 0.254: Q2.C 131.96,77.77 R18.1 130.39,74.51 127,71.12 72.39,71.12 65.09,63.82 58.74,63.82 58.13,63.21 IC1.29
TRIG_OUT
  Top 0.254: IC1.27 66.02,62.21 74.3,70.48 132.08,70.48 142.24,80.64 142.24,85.09 144.15,87 R19.1
TX
  Top 0.254: R8.2 18.17,79.2 25.59,79.2 32.26,72.53 47.5,72.53 50.05,69.98 IC1.42
V+  (via drill 0.4, 0.5, 0.6)
  Top 0.406: C48.1 IC3.4 v162.56,81.22 | C50.1 151.19,78.38 IC5.8 149.56,79.08 v151.13,80.64 | C11.+ 62.23,87.14 v62.23,86.36 62.23,81.28 67.63,75.88 v73.66,75.88 76.52,75.88 v78.74,78.11 | v73.66,68.58 v73.66,65.56
  Top 0.61: IC6.OUT 59.27,92.12 C10.1 61.81,87.63 C11.+
  Bottom 0.406: v162.56,81.22 162.5,81.28 151.13,81.28 | 151.13,81.28 v151.13,80.64 | 151.13,81.28 142.24,81.28 137.16,86.36 100.33,86.36 92.08,78.11 v78.74,78.11 | v73.66,75.88 v73.66,68.58 | v73.66,65.56 71.12,63.02 P2.1
V-  (via drill 0.4, 0.6)
  Top 0.254: C16.2 R4.2 78.74,92.39 v79.06,92.71 | C17.1 83.5,85.72 v82.55,85.72 | 87.63,87 88.69,85.94 R35.2
  Top 0.406: C49.2 IC3.11 v162.56,84.14 | C51.2 145.99,84.18 IC5.4 147,83.57 v147,83.19
  Top 0.61: L6.1 C17.1 C18.1 | C18.1 87,84.78 C19.1 | C18.1 86.68,86.05 87.63,87 v88.9,88.27 89.53,87.63 C20.-
  Bottom 0.254: v79.06,92.71 82.55,89.22 v82.55,85.72
  Bottom 0.406: 147,82.55 161.04,82.55 v162.56,84.14 162.62,83.82 163.83,82.61 163.83,63.5 158.75,58.42 88.49,58.42 87.88,57.81 82.26,57.81 81.28,56.83 P6.1 | 147,82.55 v147,83.19 | v88.9,88.27 89.53,88.9 137.16,88.9 143.51,82.55 147,82.55
VCC
  Top 0.406: C4.+ 35.56,101.13
  Top 0.61: R1.2 35.18,96.68 38.42,96.68 | 38.42,96.68 38.9,96.68 D19.3 41.88,96.91 | 41.88,96.91 C5.1 43.6,95.25 L3.1 | 41.88,96.91 39.16,94.19 | 39.16,94.19 36.77,91.81 L7.2 27.16,91.81 C6.1 | L4.1 71.67,97.16 68.49,100.33 46.99,100.33 43.57,96.91 41.88,96.91 | L2.1 39.16,91.11 39.16,94.19 | 35.56,101.13 32.23,97.79 R1.1 | D18.C C3.+ C4.+ 35.56,99.54 38.42,96.68

## Text on the board
tPlace: Cut when R1 is placed | RST | IN1 | IN2 | TRIG IN | TRIG OUT | OUT2 | OUT1 | SWCLK | SWDIO | GND | TX | RX | +9V | +3V3 | +3V3_A | AREF_-5V | -9V | GND | MiniPiano v1.0 | March 2021 | Ryo Okamoto